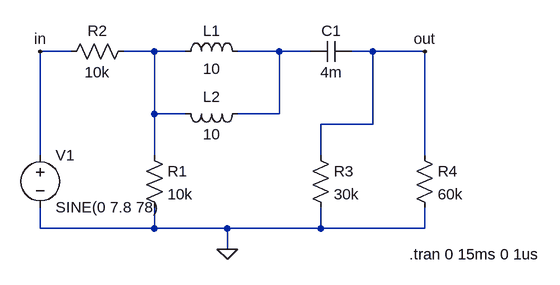
[diagram p0: schematic Draft1.asc]
Draft1.asc, the LTspice schematic file:
Version 4
SHEET 1 880 680
WIRE 96 -32 48 -32
WIRE 224 -32 176 -32
WIRE 272 -32 224 -32
WIRE 416 -32 352 -32
WIRE 464 -32 416 -32
WIRE 560 -32 528 -32
WIRE 640 -32 560 -32
WIRE 224 64 224 -32
WIRE 272 64 224 64
WIRE 416 64 416 -32
WIRE 416 64 352 64
WIRE 560 80 560 -32
WIRE 560 80 480 80
WIRE 48 128 48 -32
WIRE 224 128 224 64
WIRE 480 128 480 80
WIRE 640 128 640 -32
WIRE 48 240 48 208
WIRE 224 240 224 208
WIRE 224 240 48 240
WIRE 336 240 224 240
WIRE 480 240 480 208
WIRE 480 240 336 240
WIRE 640 240 640 208
WIRE 640 240 480 240
WIRE 336 272 336 240
FLAG 48 -32 in
FLAG 640 -32 out
FLAG 336 272 0
SYMBOL voltage 48 112 R0
WINDOW 123 0 0 Left 0
WINDOW 39 0 0 Left 0
SYMATTR InstName V1
SYMATTR Value SINE(0 7.8 78)
SYMBOL res 208 112 R0
SYMATTR InstName R1
SYMATTR Value 10k
SYMBOL res 192 -48 R90
WINDOW 0 0 56 VBottom 2
WINDOW 3 32 56 VTop 2
SYMATTR InstName R2
SYMATTR Value 10k
SYMBOL res 464 112 R0
SYMATTR InstName R3
SYMATTR Value 30k
SYMBOL res 624 112 R0
SYMATTR InstName R4
SYMATTR Value 60k
SYMBOL cap 464 -16 R270
WINDOW 0 32 32 VTop 2
WINDOW 3 0 32 VBottom 2
SYMATTR InstName C1
SYMATTR Value 4m
SYMBOL ind 256 -16 R270
WINDOW 0 32 56 VTop 2
WINDOW 3 5 56 VBottom 2
SYMATTR InstName L1
SYMATTR Value 10
SYMBOL ind 368 48 R90
WINDOW 0 5 56 VBottom 2
WINDOW 3 32 56 VTop 2
SYMATTR InstName L2
SYMATTR Value 10
TEXT 616 280 Left 2 !.tran 0 15ms 0 1us

The netlist it stands for:
* Draft1.asc
V1 in 0 SINE(0 7.8 78)
R1 N001 0 10k
R2 N001 in 10k
R3 out 0 30k
R4 out 0 60k
C1 N002 out 4m
L1 N001 N002 10
L2 N002 N001 10
.tran 0 15ms 0 1us
.backanno
.end

* Results of the author's LTspice run, read from the files saved beside the schematic
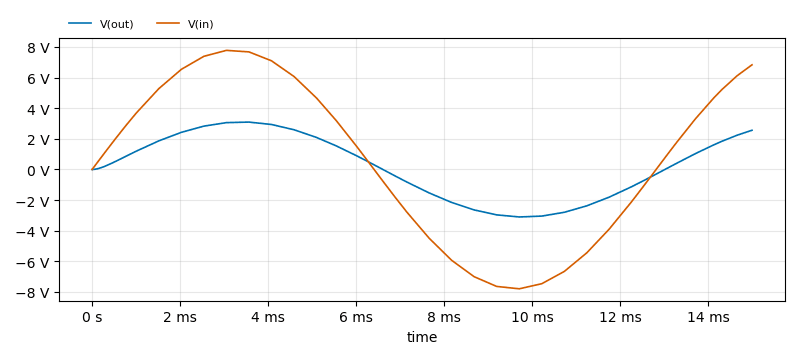
[diagram p1: Transient Analysis of Draft1.asc, plotted from the saved traces]
* Transient Analysis, 1 run:
*   V(out): min -3.101 V, max 3.095 V, average 185.5 mV, rms 2.107 V, last 2.562 V
*   V(in): min -7.791 V, max 7.779 V, average 548.9 mV, rms 5.347 V, last 6.835 V